# EAGLE design 603_ct (EAGLE 7.4.0)
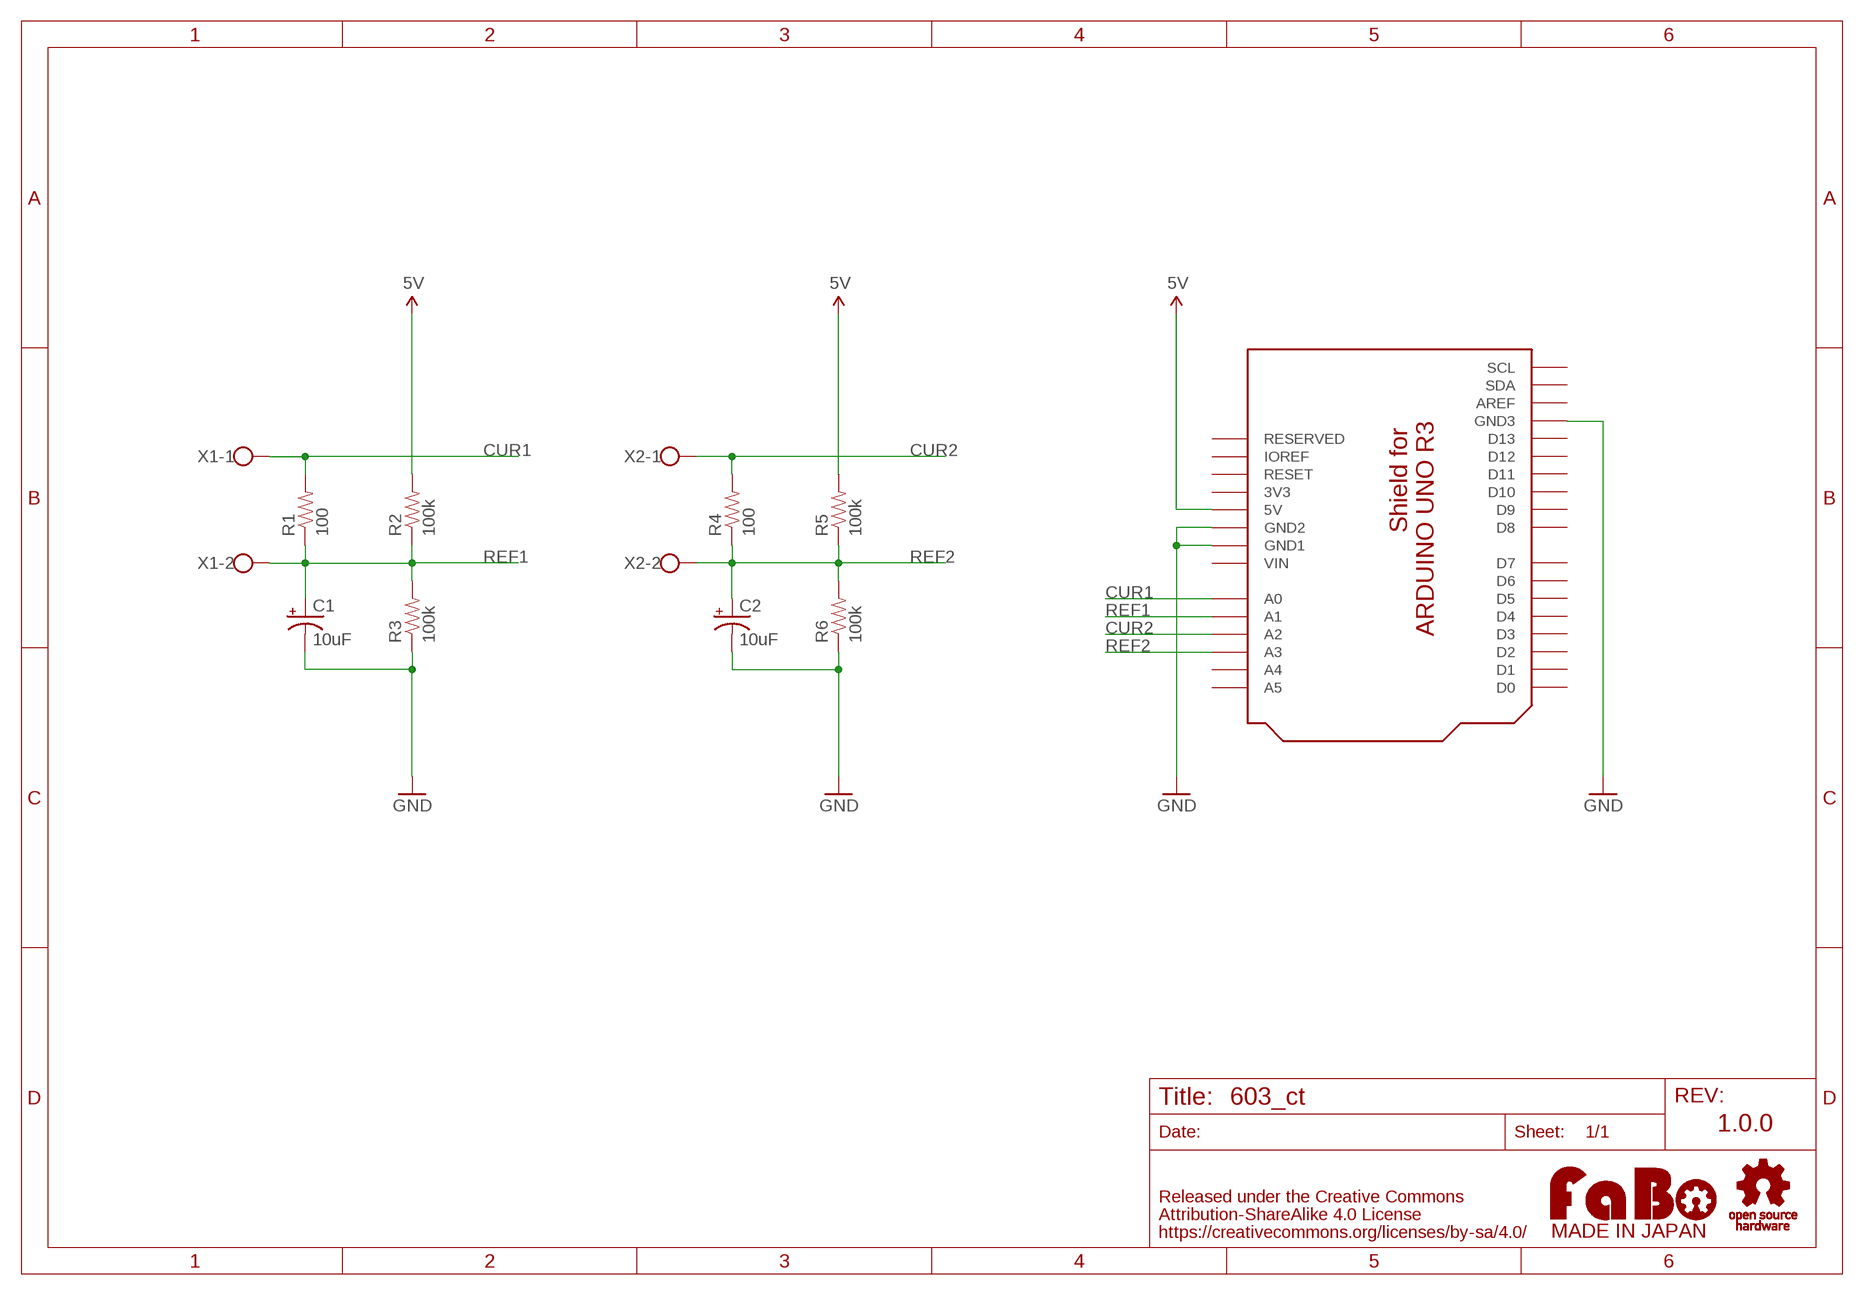
[diagram p0: schematic, sheet 1]

## Parts
C1  10uF  CAP_POL-AXL-5MM  [CAP-POL-AXL-5MM]
C2  10uF  CAP_POL-AXL-5MM  [CAP-POL-AXL-5MM]
R1  100  RES-PTH-REGULAR  [RES-AXL-REGULAR]
R2  100k  RES-PTH-REGULAR  [RES-AXL-REGULAR]
R3  100k  RES-PTH-REGULAR  [RES-AXL-REGULAR]
R4  100  RES-PTH-REGULAR  [RES-AXL-REGULAR]
R5  100k  RES-PTH-REGULAR  [RES-AXL-REGULAR]
R6  100k  RES-PTH-REGULAR  [RES-AXL-REGULAR]
U2  ARDUINO_UNO_R3_SHIELD-NOLABEL  [ARDUINO_UNO_R3_NOLABEL]
U$2  LOGO_OSHW-T_M  [LOGO_OSHW_T_MS]
U$3  LOGO_FABO-M  [LOGO_FABO_MS]
X1  W237-102  [W237-102]
X2  W237-102  [W237-102]

## Nets
5V: R2.P$2 R5.P$2 U2.5V
CUR1: R1.P$2 U2.A0 X1.1
CUR2: R4.P$2 U2.A2 X2.1
GND: C1.- C2.- R3.P$1 R6.P$1 U2.GND1 U2.GND2 U2.GND3
REF1: C1.+ R1.P$1 R2.P$1 R3.P$2 U2.A1 X1.2
REF2: C2.+ R4.P$1 R5.P$1 R6.P$2 U2.A3 X2.2
Unconnected: U2.A4 U2.A5 U2.AREF U2.D0 U2.D1 U2.D2 U2.D3 U2.D4 U2.D5 U2.D6 U2.D7 U2.D8 U2.D9 U2.D10 U2.D11 U2.D12 U2.D13 U2.IOREF U2.RESERVED U2.RESET U2.SCL U2.SDA

## Notes on the sheet
- 1.0.0

## Power pins joined to a net without a drawn wire
3V3: U2.3V3
VIN: U2.VIN

## Library data of the parts
C1 C2 = FaBo-etc:CAP_POL: Capacitor Polarized standard SMD and PTH capacitor
R1-R6 = FaBo-etc:RES
U2 = FaBo-Boards:ARDUINO_UNO_R3_SHIELD
U$2 = FaBo-etc:LOGO_OSHW
U$3 = FaBo-etc:LOGO_FABO
X1 X2 = con-wago-500:W237-102: WAGO SCREW CLAMP; MPN: 237-102; OC_FARNELL: unknown; OC_NEWARK: 70K9898

## Net classes
0 default: width 0.254 mm

## Board
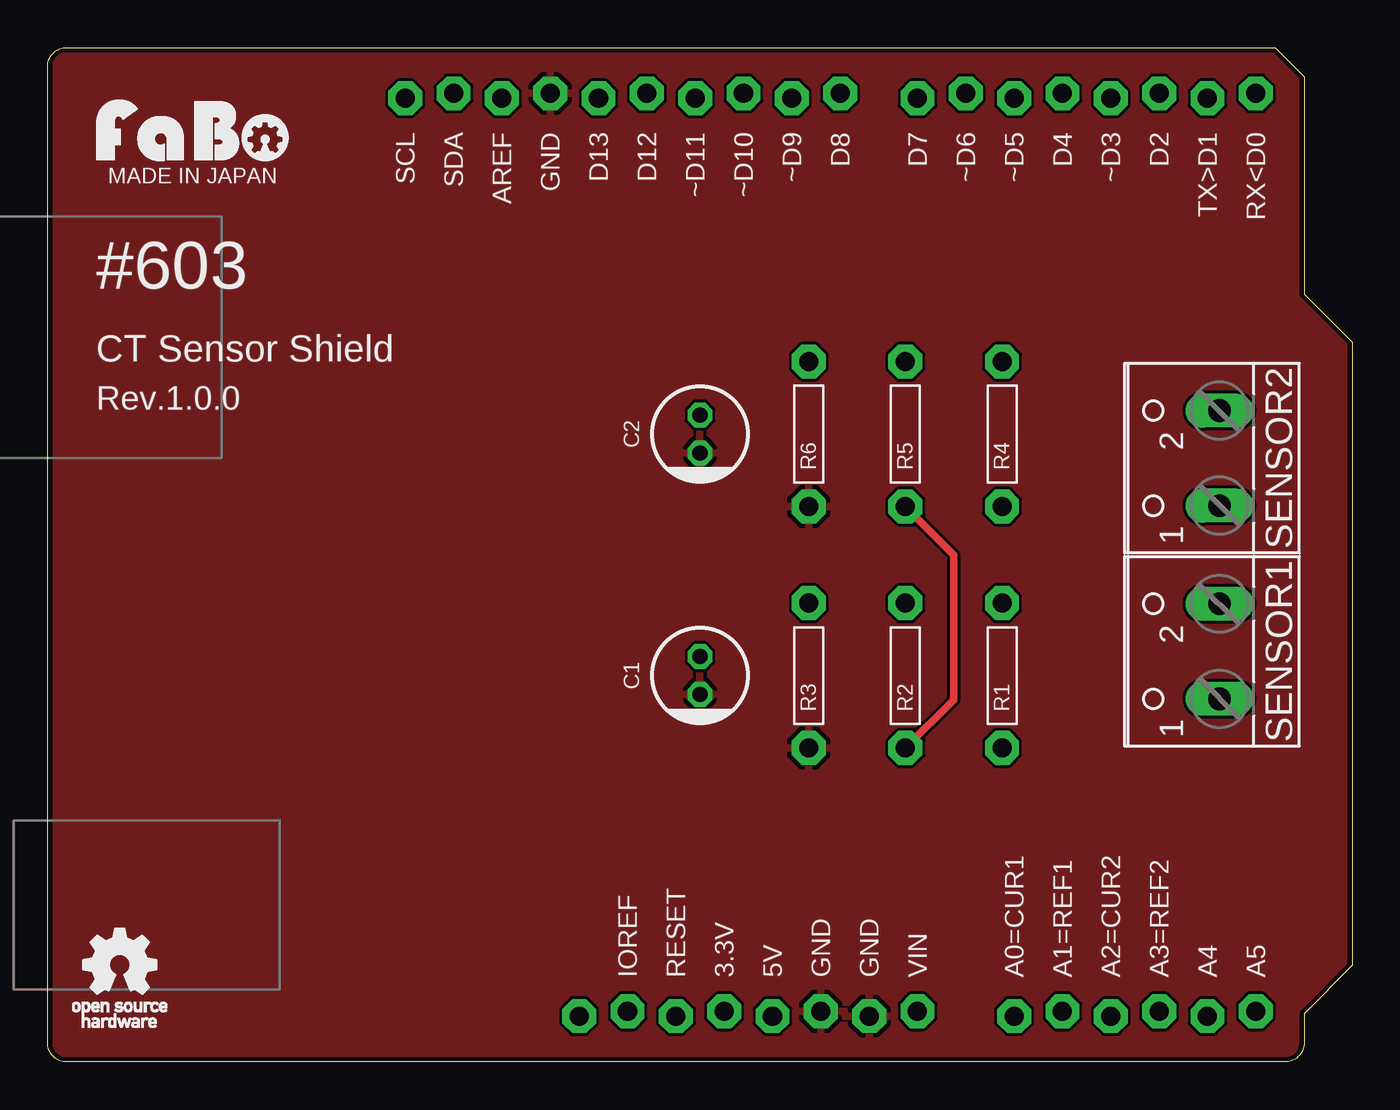
[diagram p1: board, top side]
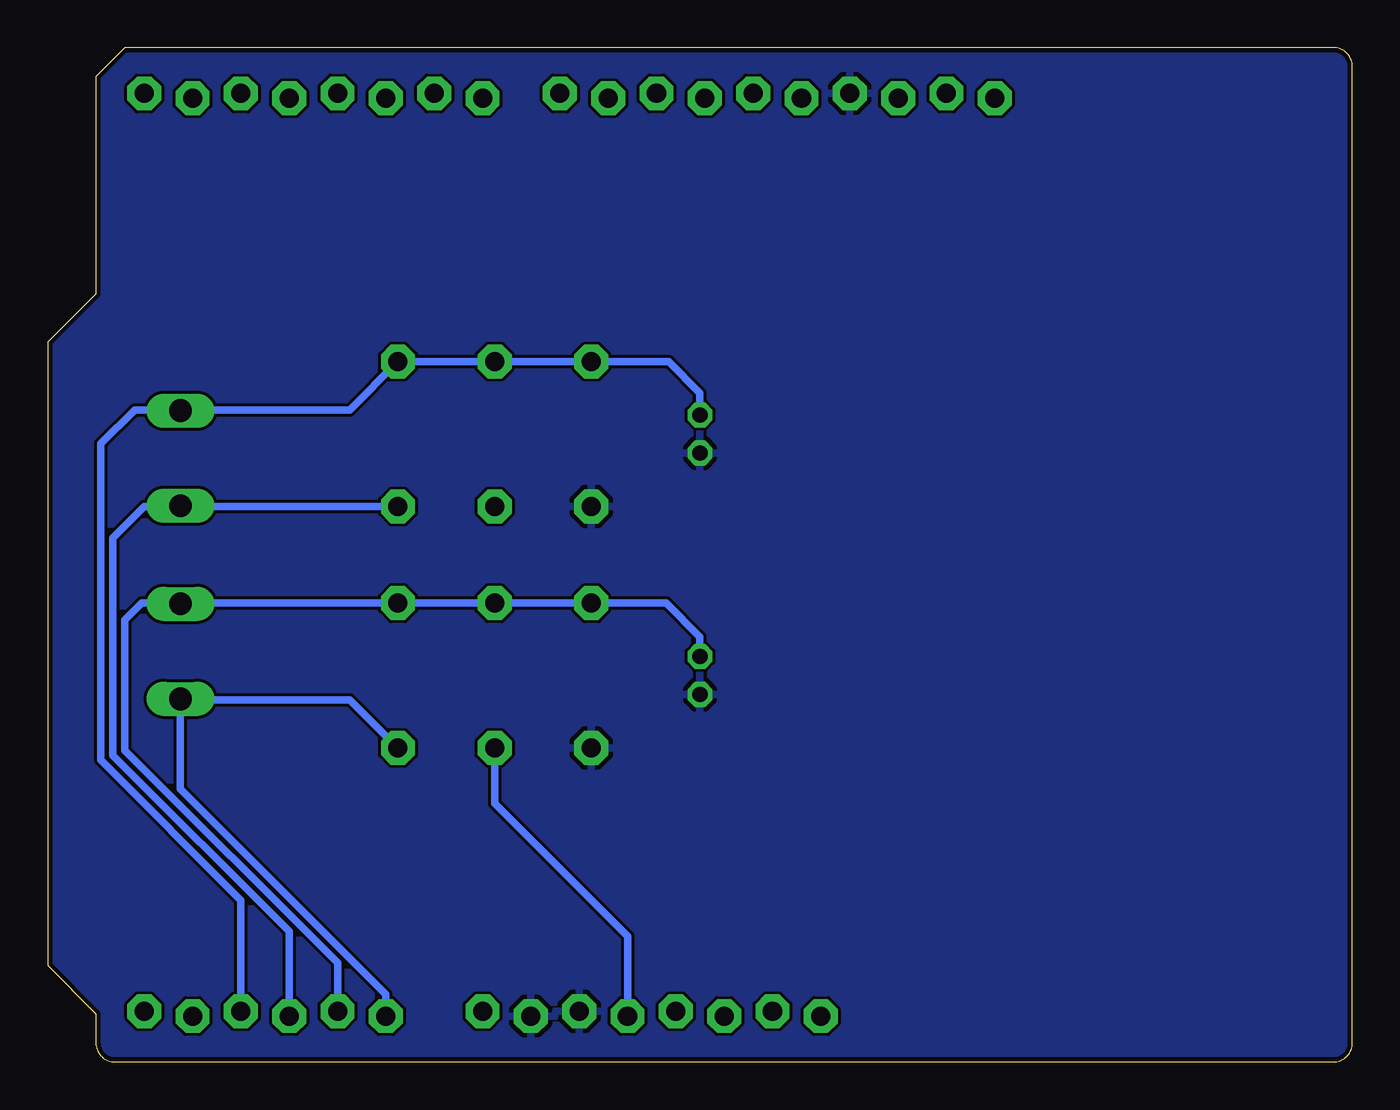
[diagram p2: board, bottom side, seen from below]

Size 68.58 x 53.34 mm. Coordinates in mm from the lower left corner, seen from the top.
Copper layers (1*16): Top 0.035mm / dielectric 1.5mm / Bottom 0.035mm
Design rules "Elecrow_2-layer_eagle_rule": minimum track width 6mil, minimum drill 12mil, track to track 6mil, track to pad 6mil, pad to pad 6mil, via to via 6mil, smd to smd 0mil, copper to edge 10mil, drill to drill 10mil, minimum pad ring 10mil, minimum via ring 6mil, stop-mask expansion 2mil, vias tented up to drill 100mil, thermal gap 10mil

### Footprints (pad centres in the part's own frame; a part is rotated, then mirrored left to right if it is on the bottom)
CAP-POL-AXL-5MM = drill 0.8 octagon: + 1,0; - -1,0
RES-AXL-REGULAR = drill 1 pad 1.778 octagon: P$1 -3.81,0; P$2 3.81,0
ARDUINO_UNO_R3_NOLABEL = drill 1 pad 1.778 octagon: 3V3 35.56,2.667; 5V 38.1,2.413; A0 50.8,2.413; A1 53.34,2.667; A2 55.88,2.413; A3 58.42,2.667; A4 60.96,2.413; A5 63.5,2.667; AREF 23.876,50.673; D0 63.5,50.927; D1 60.96,50.673; D2 58.42,50.927; D3 55.88,50.673; D4 53.34,50.927; D5 50.8,50.673; D6 48.26,50.927; D7 45.72,50.673; D8 41.656,50.927; D9 39.116,50.673; D10 36.576,50.927; D11 34.036,50.673; D12 31.496,50.927; D13 28.956,50.673; GND1 43.18,2.413; GND2 40.64,2.667; GND3 26.416,50.927; IOREF 30.48,2.667; RESERVED 27.94,2.413; RESET 33.02,2.413; SCL 18.796,50.673; SDA 21.336,50.927; VIN 45.72,2.667
W237-102 = drill 1.194 long: 1 -2.5,-1.27; 2 2.5,-1.27

### Placement (x,y rotation side)
C1  34.29,20.32 90 top
C2  34.29,33.02 90 top
R1  50.16,20.32 270 top
R2  45.09,20.32 270 top
R3  40.01,20.32 90 top
R4  50.16,33.02 270 top
R5  45.09,33.02 270 top
R6  40.01,33.02 90 top
U2  0,0 0 top
U$2  3.81,5.08 0 top
U$3  7.62,46.99 0 top
X1  60.33,21.59 90 top
X2  60.33,31.75 90 top

### Tracks (layer width: path | path; a pad name or v marks a point on that pad's centre or on a via)
5V
  Top 0.406: R5.P$2 47.62,26.67 47.62,19.05 R2.P$2
  Bottom 0.406: U2.5V 38.1,6.6 45.09,13.59 R2.P$2
CUR1
  Bottom 0.406: R1.P$2 52.7,19.05 61.47,19.05 61.51,19.09 X1.1 61.59,14.35 50.8,3.56 U2.A0
CUR2
  Bottom 0.406: X2.1 61.38,29.25 61.34,29.21 | 61.34,29.21 R4.P$2 | 61.34,29.21 63.5,29.21 65.15,27.56 65.15,16.13 55.88,6.86 U2.A2
GND
  pour Bottom: -1.27,-1.27 69.85,-1.27 69.85,54.61 -1.27,54.61
  pour Top: -1.27,-1.27 69.85,-1.27 69.85,54.61 -1.27,54.61
REF1
  Bottom 0.406: C1.+ 34.29,22.35 36.07,24.13 R3.P$2 R2.P$1 R1.P$1 61.47,24.13 61.47,24.09 X1.2 61.68,24.09 61.72,24.13 63.63,24.13 64.52,23.24 64.52,16.38 53.34,5.21 U2.A1
REF2
  Bottom 0.406: C2.+ 34.29,35.18 35.94,36.83 R6.P$2 R5.P$1 R4.P$1 52.7,34.29 61.47,34.29 61.51,34.25 X2.2 61.63,34.29 64.01,34.29 65.79,32.51 65.79,15.88 58.42,8.51 U2.A3

### Text on the board
tPlace: SCL | SDA | AREF | GND | D13 | D12 | ~D11 | ~D10 | ~D9 | D8 | D7 | ~D6 | ~D5 | D4 | ~D3 | D2 | TX>D1 | RX<D0 | MADE IN JAPAN | #603 | CT Sensor Shield | Rev.1.0.0 | SENSOR2 | SENSOR1 | IOREF | RESET | 3.3V | 5V | GND | GND | VIN | A0=CUR1 | A1=REF1 | A2=CUR2 | A3=REF2 | A4 | A5